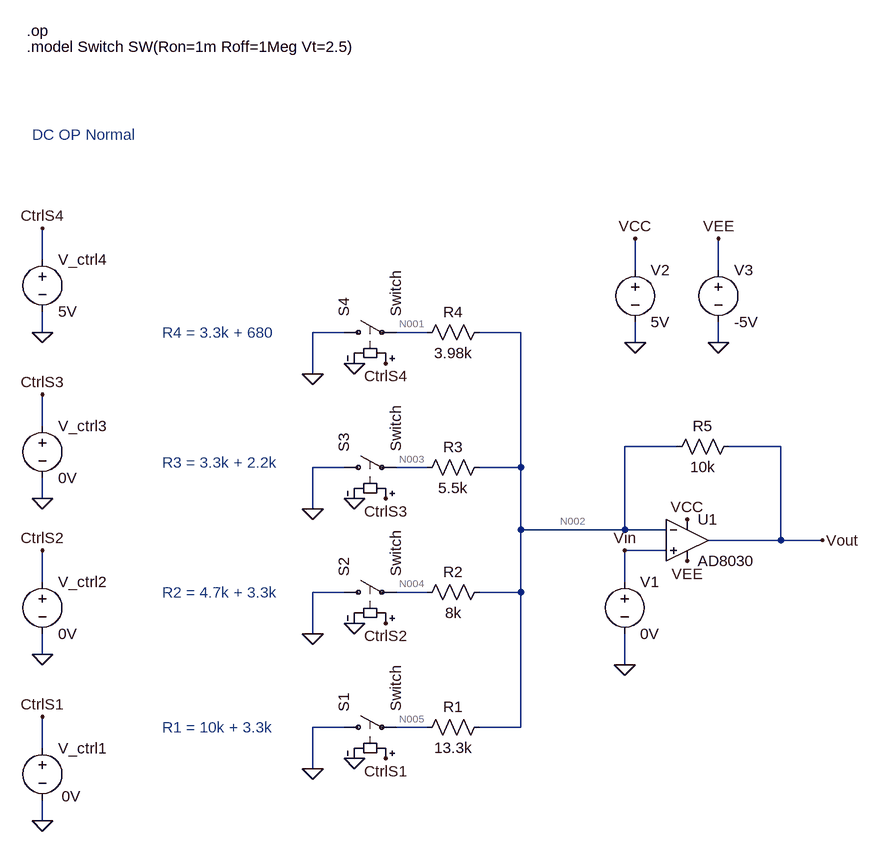
[diagram p0: schematic Etaj 3 - DCOP.asc]
Etaj 3 - DCOP.asc, the LTspice schematic file:
Version 4.1
SHEET 1 1980 2004
WIRE -208 -80 -208 -128
WIRE 704 -64 704 -112
WIRE 832 -64 832 -112
WIRE -208 32 -208 0
WIRE 256 32 208 32
WIRE 384 32 336 32
WIRE 528 32 464 32
WIRE 704 48 704 16
WIRE 832 48 832 16
WIRE 208 96 208 32
WIRE -208 176 -208 128
WIRE 768 208 688 208
WIRE 928 208 848 208
WIRE 256 240 208 240
WIRE 384 240 336 240
WIRE 528 240 528 32
WIRE 528 240 464 240
WIRE -208 288 -208 256
WIRE 208 304 208 240
WIRE 528 336 528 240
WIRE 688 336 688 208
WIRE 688 336 528 336
WIRE 752 336 688 336
WIRE 928 352 928 208
WIRE 928 352 816 352
WIRE 992 352 928 352
WIRE 752 368 688 368
WIRE -208 416 -208 368
WIRE 688 416 688 368
WIRE 256 432 208 432
WIRE 384 432 336 432
WIRE 528 432 528 336
WIRE 528 432 464 432
WIRE 208 496 208 432
WIRE -208 528 -208 496
WIRE 688 544 688 496
WIRE 256 640 208 640
WIRE 384 640 336 640
WIRE 528 640 528 432
WIRE 528 640 464 640
WIRE -208 672 -208 624
WIRE 208 704 208 640
WIRE -208 784 -208 752
FLAG 208 96 0
FLAG 208 304 0
FLAG 208 496 0
FLAG 208 704 0
FLAG 688 544 0
FLAG 992 352 Vout
FLAG 272 80 0
FLAG 272 288 0
FLAG 272 480 0
FLAG 272 688 0
FLAG -208 32 0
FLAG -208 288 0
FLAG -208 528 0
FLAG -208 784 0
FLAG -208 624 CtrlS1
FLAG 320 688 CtrlS1
FLAG -208 368 CtrlS2
FLAG 320 480 CtrlS2
FLAG -208 128 CtrlS3
FLAG 320 288 CtrlS3
FLAG -208 -128 CtrlS4
FLAG 320 80 CtrlS4
FLAG 704 48 0
FLAG 832 48 0
FLAG 704 -112 VCC
FLAG 784 320 VCC
FLAG 832 -112 VEE
FLAG 784 384 VEE
FLAG 688 368 Vin
DATAFLAG 928 352 ""
DATAFLAG 928 352 ""
SYMBOL sw 240 32 R270
SYMATTR InstName S4
SYMATTR Value Switch
SYMBOL sw 240 240 R270
SYMATTR InstName S3
SYMATTR Value Switch
SYMBOL sw 240 432 R270
SYMATTR InstName S2
SYMATTR Value Switch
SYMBOL sw 240 640 R270
SYMATTR InstName S1
SYMATTR Value Switch
SYMBOL res 480 16 R90
WINDOW 0 0 56 VBottom 2
WINDOW 3 32 56 VTop 2
SYMATTR InstName R4
SYMATTR Value 3.98k
SYMBOL res 480 224 R90
WINDOW 0 0 56 VBottom 2
WINDOW 3 32 56 VTop 2
SYMATTR InstName R3
SYMATTR Value 5.5k
SYMBOL res 480 416 R90
WINDOW 0 0 56 VBottom 2
WINDOW 3 32 56 VTop 2
SYMATTR InstName R2
SYMATTR Value 8k
SYMBOL res 480 624 R90
WINDOW 0 0 56 VBottom 2
WINDOW 3 32 56 VTop 2
SYMATTR InstName R1
SYMATTR Value 13.3k
SYMBOL OpAmps\\AD8030 784 288 R0
SYMATTR InstName U1
SYMBOL res 864 192 R90
WINDOW 0 0 56 VBottom 2
WINDOW 3 32 56 VTop 2
SYMATTR InstName R5
SYMATTR Value 10k
SYMBOL voltage 688 400 R0
WINDOW 123 0 0 Left 0
WINDOW 39 0 0 Left 0
SYMATTR InstName V1
SYMATTR Value 0V
SYMBOL voltage -208 656 R0
WINDOW 3 30 90 Left 2
WINDOW 123 0 0 Left 0
WINDOW 39 0 0 Left 0
SYMATTR Value 0V
SYMATTR InstName V_ctrl1
SYMBOL voltage -208 400 R0
WINDOW 123 0 0 Left 0
WINDOW 39 0 0 Left 0
SYMATTR InstName V_ctrl2
SYMATTR Value 0V
SYMBOL voltage -208 160 R0
WINDOW 123 0 0 Left 0
WINDOW 39 0 0 Left 0
SYMATTR InstName V_ctrl3
SYMATTR Value 0V
SYMBOL voltage -208 -96 R0
WINDOW 123 0 0 Left 0
WINDOW 39 0 0 Left 0
SYMATTR InstName V_ctrl4
SYMATTR Value 5V
SYMBOL voltage 704 -80 R0
WINDOW 123 0 0 Left 0
WINDOW 39 0 0 Left 0
SYMATTR InstName V2
SYMATTR Value 5V
SYMBOL voltage 832 -80 R0
WINDOW 123 0 0 Left 0
WINDOW 39 0 0 Left 0
SYMATTR InstName V3
SYMATTR Value -5V
TEXT -232 -408 Left 2 !.model Switch SW(Ron=1m Roff=1Meg Vt=2.5)
TEXT -24 640 Left 2 ;R1 = 10k + 3.3k
TEXT -24 432 Left 2 ;R2 = 4.7k + 3.3k
TEXT -24 232 Left 2 ;R3 = 3.3k + 2.2k
TEXT -24 32 Left 2 ;R4 = 3.3k + 680
TEXT -232 -432 Left 2 !.op
TEXT -224 -272 Left 2 ;DC OP Normal

The netlist it stands for:
* Etaj 3 - DCOP.asc
S4 0 N001 CtrlS4 0 Switch
S3 0 N003 CtrlS3 0 Switch
S2 0 N004 CtrlS2 0 Switch
S1 0 N005 CtrlS1 0 Switch
R4 N002 N001 3.98k
R3 N002 N003 5.5k
R2 N002 N004 8k
R1 N002 N005 13.3k
X§U1 Vin N002 VCC VEE Vout AD8040  ; AD8030, pins In+ In- V+ V- OUT
R5 Vout N002 10k
V1 Vin 0 0V
V_ctrl1 CtrlS1 0 0V
V_ctrl2 CtrlS2 0 0V
V_ctrl3 CtrlS3 0 0V
V_ctrl4 CtrlS4 0 5V
V2 VCC 0 5V
V3 VEE 0 -5V
.model Switch SW(Ron=1m Roff=1Meg Vt=2.5)
* R1 = 10k + 3.3k
* R2 = 4.7k + 3.3k
* R3 = 3.3k + 2.2k
* R4 = 3.3k + 680
.op
* DC OP Normal
.lib ADI.lib
.backanno
.end

* Results of the author's LTspice run, read from the files saved beside the schematic
* Operating Point:
*   V(ctrls1) = 0 V
*   V(ctrls2) = 0 V
*   V(ctrls3) = 0 V
*   V(ctrls4) = 5 V
*   V(n001) = 100.5 fV
*   V(n002) = 399.8 nV
*   V(n003) = 397.6 nV
*   V(n004) = 396.6 nV
*   V(n005) = 394.6 nV
*   V(vcc) = 5 V
*   V(vee) = -5 V
*   V(vin) = 0 V
*   V(vout) = -17 mV
*   I(R1) = 394.6 fA
*   I(R2) = 396.6 fA
*   I(R3) = 397.6 fA
*   I(R4) = 100.5 pA
*   I(R5) = -1.7 µA
*   I(S1) = 394.6 fA
*   I(S2) = 396.6 fA
*   I(S3) = 397.6 fA
*   I(S4) = 100.5 pA
*   I(V1) = 1.7 µA
*   I(V2) = -1.304 mA
*   I(V3) = 1.303 mA
*   I(V_ctrl1) = 0 A
*   I(V_ctrl2) = 0 A
*   I(V_ctrl3) = 0 A
*   I(V_ctrl4) = 0 A
*   Ix(u1:1) = -1.7 µA
*   Ix(u1:2) = -1.7 µA
*   Ix(u1:3) = 1.304 mA
*   Ix(u1:4) = -1.303 mA
*   Ix(u1:5) = 1.7 µA